# Altium project dashcam_bb_v2.0.PrjPcb (part 8 of 8)

## Sheet mipi_deserializer_poc.SchDoc
size A4; DrawnBy: Elio F; Engineer: Elio F; SheetNumber: 11; SheetTotal: 11; Sheet Title: Mipi Deserilizer LDO
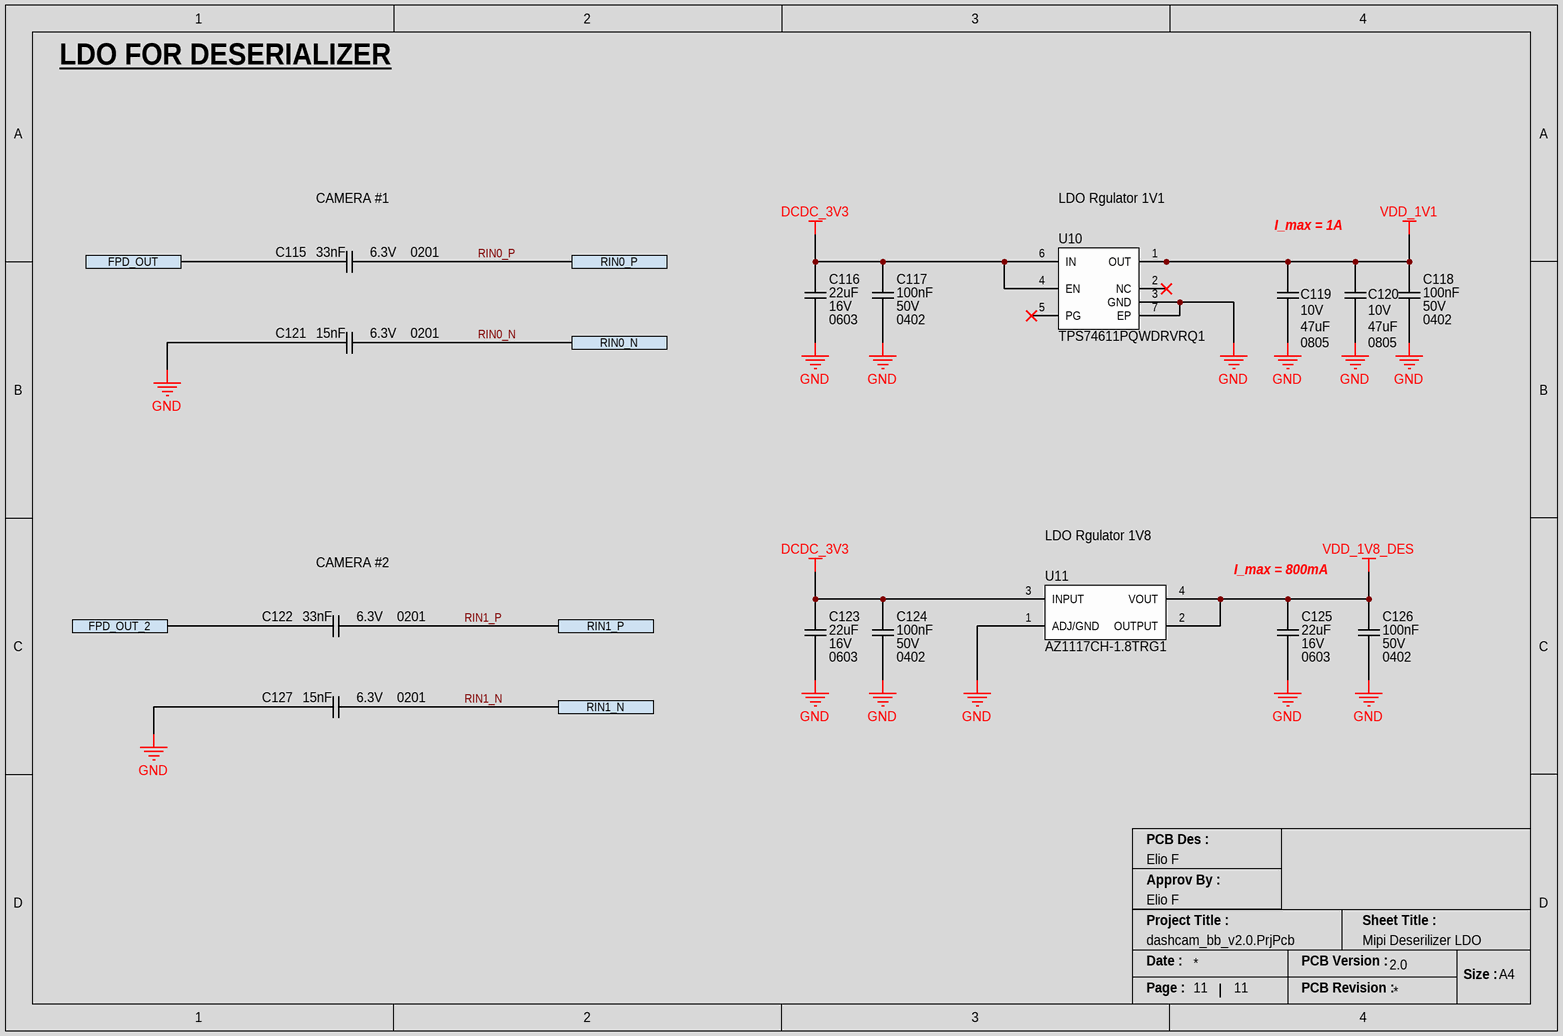
[diagram p11: mipi_deserializer_poc.SchDoc]

### Parts
C115  Voltage Rating: 6.3V  Capacitance: 33nF  Case/Package: 0201  [CAP_0201_CAPC0603X03N]  (hidden comment: GRM033R60J333KE01D)
C116  Capacitance: 22uF  Voltage Rating: 16V  Case/Package: 0603  [CAP_0603_CAPC1608X08N]  (hidden comment: CL10A226MO7JZNC)
C117  Voltage Rating: 50V  Capacitance: 100nF  Case/Package: 0402  [CAP_0402_CAPC1005X05N]  (hidden comment: GRM155R71H104KE14D)
C118  Voltage Rating: 50V  Capacitance: 100nF  Case/Package: 0402  [CAP_0402_CAPC1005X05N]  (hidden comment: GRM155R71H104KE14D)
C119  Voltage Rating (DC): 10V  Capacitance: 47uF  Case Code (Imperial): 0805  [CAP_0805_CAPC2012X12N]  (hidden comment: C2012X5R1A476M125AC)
C120  Voltage Rating (DC): 10V  Capacitance: 47uF  Case Code (Imperial): 0805  [CAP_0805_CAPC2012X12N]  (hidden comment: C2012X5R1A476M125AC)
C121  Voltage Rating: 6.3V  Capacitance: 15nF  Case/Package: 0201  [CAP_0201_CAPC0603X03N]  (hidden comment: GRM033R60J153KE01D)
C122  Voltage Rating: 6.3V  Capacitance: 33nF  Case/Package: 0201  [CAP_0201_CAPC0603X03N]  (hidden comment: GRM033R60J333KE01D)
C123  Capacitance: 22uF  Voltage Rating: 16V  Case/Package: 0603  [CAP_0603_CAPC1608X08N]  (hidden comment: CL10A226MO7JZNC)
C124  Voltage Rating: 50V  Capacitance: 100nF  Case/Package: 0402  [CAP_0402_CAPC1005X05N]  (hidden comment: GRM155R71H104KE14D)
C125  Capacitance: 22uF  Voltage Rating: 16V  Case/Package: 0603  [CAP_0603_CAPC1608X08N]  (hidden comment: CL10A226MO7JZNC)
C126  Voltage Rating: 50V  Capacitance: 100nF  Case/Package: 0402  [CAP_0402_CAPC1005X05N]  (hidden comment: GRM155R71H104KE14D)
C127  Voltage Rating: 6.3V  Capacitance: 15nF  Case/Package: 0201  [CAP_0201_CAPC0603X03N]  (hidden comment: GRM033R60J153KE01D)
U10  TPS74611PQWDRVRQ1  [IC_REG_LDO_1.1V_SON65P200X200X80-7N]
U11  AZ1117CH-1.8TRG1  [SOT230P700X180-4N]

### Ports
FPD_OUT, FPD_OUT_2, RIN0_N, RIN0_P, RIN1_N, RIN1_P

### Nets
DCDC_3V3: C116.2 C117.2 C123.2 C124.2 U10.4(EN) U10.6(IN) U11.3(INPUT)
GND: C116.1 C117.1 C118.1 C119.1 C120.1 C121.1 C123.1 C124.1 C125.1 C126.1 C127.1 U10.3(GND) U10.7(EP) U11.1(ADJ/GND)
VDD_1V1: C118.2 C119.2 C120.2 U10.1(OUT)
VDD_1V8_DES: C125.2 C126.2 U11.2(OUTPUT) U11.4(VOUT)
FPD_OUT: C115.1 ; port FPD_OUT
FPD_OUT_2: C122.1 ; port FPD_OUT_2
RIN0_N: C121.2 ; port RIN0_N
RIN0_P: C115.2 ; port RIN0_P
RIN1_N: C127.2 ; port RIN1_N
RIN1_P: C122.2 ; port RIN1_P

Not connected (* = marked no-connect by the designer): U10 2(NC)* 5(PG)*

### Notes on the sheet
- LDO FOR DESERIALIZER
- CAMERA #1
- LDO Rgulator 1V1
- I_max = 1A
- CAMERA #2
- LDO Rgulator 1V8
- I_max = 800mA
- PCB Des :
- Approv By :
- Project Title :
- Sheet Title :
- Date :
- PCB Version :
- Size :
- A4
- Page :
- PCB Revision :

### Library data of the parts
C115 C122 = CAP_0.033uF_6.3V_X5R_0201: Multilayer Ceramic Capacitor, 0.033 uF, 6.3 V, ± 10%, X5R, 0201 [0603 Metric]; Manufacturer: Murata; Dissipation Factor: 0.1%; Supplier 1: Mouser; Manufacturer Part Number: GRM033R60J333KE01D; RoHS: Yes; Category: Ceramic Capacitors; Stock 1: 164761; Pricing 1: 1=0.1, 10=0.017, 50=0.017, 100=0.011, 1000=0.01, 10000=0.008 (USD); Mount: Surface Mount; Case Code (Metric): 0603; Case Code (Imperial): 0201; Material: Ceramic; Min Operating Temperature: -55°C; Max Operating Temperature: 85°C; Tolerance: 10%; Packaging: Tape and Reel; Voltage Rating (DC): 6.3V; Package Quantity: 1; Dielectric: X5R; Termination: SMD/SMT; Voltage: 6.3V; Series: GRM; Construction: Flat; Length: 0.6mm; Width: 0.012inch; Height: 0.3mm; Thickness: 0.013inch; Depth: 0.3mm; Radiation Hardening: No; Reach SVHC Compliant: No; Lead Free: Lead Free; RoHS Compliant: Yes; ComponentLink1URL: https://datasheet.ciiva.com/131/product-131104.pdf?src-supplier=Digikey; ComponentLink1Description: https://datasheet.ciiva.com/131/product-131104.pdf?src-supplier=Digikey; ComponentLink2URL: https://datasheet.ciiva.com/18184/getdatasheetpartid-220776-18184045.pdf?src-supplier=Verical; ComponentLink2Description: https://datasheet.ciiva.com/18184/getdatasheetpartid-220776-18184045.pdf?src-supplier=Verical; ComponentLink3URL: https://datasheet.ciiva.com/29199/455665-da-01-en-vs-kondensator-0201-29199269.pdf?src-supplier=Conrad; ComponentLink3Description: https://datasheet.ciiva.com/29199/455665-da-01-en-vs-kondensator-0201-29199269.pdf?src-supplier=Conrad; ComponentLink4URL: https://datasheet.ciiva.com/11605/product-11605453.pdf?src-supplier=Avnet; ComponentLink4Description: https://datasheet.ciiva.com/11605/product-11605453.pdf?src-supplier=Avnet; ComponentLink5URL: https://datasheet.ciiva.com/16199/product-16199350.pdf?src-supplier=Future+Electronics; ComponentLink5Description: https://datasheet.ciiva.com/16199/product-16199350.pdf?src-supplier=Future+Electronics; Supplier Part Number 1: 81-GRM033R60J333KE01
C116 C123 C125 = CAP_22UF_16V_X5R_0603: Cap Ceramic 22uF 16V X5R 20% Pad SMD 0603 85C T/R; Manufacturer: Samsung; Supplier 1: Digi-Key; Manufacturer Part Number: CL10A226MO7JZNC; RoHS: Yes; Category: Ceramic Capacitors; Stock 1: 1760065; Pricing 1: 1=0.59, 10=0.419, 50=0.3164, 100=0.2756, 500=0.20418, 1000=0.17355 (USD); Mount: Surface Mount; Case Code (Imperial): 0603; Case Code (Metric): 1608; Min Operating Temperature: -55°C; Max Operating Temperature: 85°C; Packaging: Cut Tape; Tolerance: 20%; Series: CL; RoHS Compliant: Yes; ComponentLink1URL: http://www.samsungsem.com/kr/support/product-search/mlcc/CL10A226MO7JZNC.jsp?src-supplier=Digi-Key; ComponentLink1Description: http://www.samsungsem.com/kr/support/product-search/mlcc/CL10A226MO7JZNC.jsp?src-supplier=Digi-Key; ComponentLink2URL: https://datasheet.octopart.com/CL10A226MO7JZNC-Samsung-Electro-Mechanics-datasheet-149156497.pdf?src-supplier=Future+Electronics; ComponentLink2Description: https://datasheet.octopart.com/CL10A226MO7JZNC-Samsung-Electro-Mechanics-datasheet-149156497.pdf?src-supplier=Future+Electronics; Supplier Part Number 1: 1276-7076-1-ND
C117 C118 C124 C126 = CAP_100NF_50V_X7R_0402: Multilayer Ceramic Capacitor, 0.1 uF, 16 V, ± 10%, X7R, 0402 [1005 Metric]; Manufacturer: Murata; Dissipation Factor: 0.025%; Temperature Coefficient: 30ppm/°C; Supplier 1: DigiKey; Manufacturer Part Number: GRM155R71H104KE14D; RoHS: Yes; Category: Ceramic Capacitors; Stock 1: 13730790; Pricing 1: 1=0.1, 10=0.023, 50=0.0132, 100=0.0102, 500=0.00768, 1000=0.00603, 2500=0.00548, 5000=0.00504 (USD); Mount: Surface Mount; Number of Pins: 2NUMBER; Case Code (Metric): 1005; Material: Ceramic; Case Code (Imperial): 0402; Weight: 0.000212oz; Dielectric Material: Ceramic; Min Operating Temperature: -55°C; Max Operating Temperature: 125°C; Packaging: Tape and Reel; Package Quantity: 10000; Series: GRM; Tolerance: 10%; Dielectric: X7R; Termination: SMD/SMT; Voltage: 50V; Voltage Rating (DC): 50V; Construction: Flat; Length: 1mm; Width: 0.5mm; Height: 0.5mm; Depth: 0.5mm; Thickness: 0.022inch; Reach SVHC Compliant: No; RoHS Compliant: Yes; Lead Free: 5697LeadFree; ComponentLink1URL: http://www.farnell.com/datasheets/2079156.pdf?src-supplier=Farnell; ComponentLink1Description: http://www.farnell.com/datasheets/2079156.pdf?src-supplier=Farnell; ComponentLink2URL: http://www.mouser.com/ds/2/281/c02e-2905.pdf?src-supplier=Mouser; ComponentLink2Description: http://www.mouser.com/ds/2/281/c02e-2905.pdf?src-supplier=Mouser; ComponentLink3URL: http://www.farnell.com/datasheets/2079156.pdf?src-supplier=Newark; ComponentLink3Description: http://www.farnell.com/datasheets/2079156.pdf?src-supplier=Newark; ComponentLink4URL: https://datasheet.octopart.com/GRM155R71H104KE14D-Murata-datasheet-22122223.pdf?src-supplier=Future+Electronics; ComponentLink4Description: https://datasheet.octopart.com/GRM155R71H104KE14D-Murata-datasheet-22122223.pdf?src-supplier=Future+Electronics; ComponentLink5URL: https://search.murata.co.jp/Ceramy/image/img/A01X/G101/ENG/GRM155R71H104KE14-01.pdf?src-supplier=Digi-Key; ComponentLink5Description: https://search.murata.co.jp/Ceramy/image/img/A01X/G101/ENG/GRM155R71H104KE14-01.pdf?src-supplier=Digi-Key; ComponentLink6URL: http://psearch.en.murata.com/capacitor/product/GRM155R71H104KE14%23.pdf?src-supplier=Avnet; ComponentLink6Description: http://psearch.en.murata.com/capacitor/product/GRM155R71H104KE14%23.pdf?src-supplier=Avnet; ComponentLink7URL: https://datasheet.octopart.com/GRM155R71H104KE14D-Murata-datasheet-66077078.pdf?src-supplier=Element14; ComponentLink7Description: https://datasheet.octopart.com/GRM155R71H104KE14D-Murata-datasheet-66077078.pdf?src-supplier=Element14; Supplier Part Number 1: 490-10700-6-ND; Supplier 2: Digikey; Stock 2: 3706055; Pricing 2: 1=0.1, 10=0.037, 50=0.021, 100=0.0162, 500=0.01224, 1000=0.00961, 2500=0.00874, 5000=0.00804 (USD); Halogen Free: 5694HalogenFree; ComponentLink8URL: http://www.mouser.com/ds/2/447/UPY-GPHC_X5R_4V-to-50V_25-1131599.pdf?src-supplier=Mouser; ComponentLink8Description: http://www.mouser.com/ds/2/447/UPY-GPHC_X5R_4V-to-50V_25-1131599.pdf?src-supplier=Mouser; ComponentLink9URL: https://datasheet.octopart.com/CC0402KRX5R8BB104-Yageo-datasheet-137700082.pdf?src-supplier=Future+Electronics; ComponentLink9Description: https://datasheet.octopart.com/CC0402KRX5R8BB104-Yageo-datasheet-137700082.pdf?src-supplier=Future+Electronics; ComponentLink10URL: http://www.yageo.com/documents/recent/UPY-GPHC_X5R_4V-to-50V_25.pdf?src-supplier=Digikey; ComponentLink10Description: http://www.yageo.com/documents/recent/UPY-GPHC_X5R_4V-to-50V_25.pdf?src-supplier=Digikey; ComponentLink11URL: https://datasheet.octopart.com/CC0402KRX5R8BB104-Yageo-datasheet-140260304.pdf?src-supplier=Newark; ComponentLink11Description: https://datasheet.octopart.com/CC0402KRX5R8BB104-Yageo-datasheet-140260304.pdf?src-supplier=Newark; ComponentLink12URL: https://datasheet.octopart.com/CC0402KRX5R8BB104-Yageo-datasheet-170350636.pdf?src-supplier=Future+Electronics; ComponentLink12Description: https://datasheet.octopart.com/CC0402KRX5R8BB104-Yageo-datasheet-170350636.pdf?src-supplier=Future+Electronics; ComponentLink13URL: http://www.yageo.com/documents/recent/UPY-GPHC_X5R_4V-to-50V-16.pdf?src-supplier=Future+Electronics; ComponentLink13Description: http://www.yageo.com/documents/recent/UPY-GPHC_X5R_4V-to-50V-16.pdf?src-supplier=Future+Electronics; Supplier Part Number 2: 311-1697-1-ND
C119 C120 = CAP_47UF_10V_X5R_0805: Multilayer Ceramic Capacitor, 47 uF, 10 V, ± 20%, X5R, 0805 [2012 Metric]; Manufacturer: TDK; Material: 4241ConductorMaterial; Supplier 1: Digikey; Manufacturer Part Number: C2012X5R1A476M125AC; RoHS: Yes; Category: Ceramic Capacitors; Stock 1: 476295; Pricing 1: 1=0.79, 10=0.572, 50=0.5006, 100=0.4079, 500=0.33372, 1000=0.28737 (USD); Mount: Surface Mount; Case/Package: 0805; Dielectric Material: Ceramic; Case Code (Metric): 2012; Weight: 0.000194oz; Min Operating Temperature: -55°C; Max Operating Temperature: 85°C; Tolerance: 20%; Packaging: Tape and Reel; Dielectric: X5R; Package Quantity: 1; Voltage Rating: 10V; Termination: SMD/SMT; Voltage: 10V; Series: C; Length: 2mm; Width: 0.049inch; Height: 1.25mm; Depth: 1.25mm; Thickness: 0.057inch; Lead Free: Lead Free; Reach SVHC Compliant: No; RoHS Compliant: Yes; ComponentLink1URL: https://datasheet.ciiva.com/24216/c2012x5r1a476m125ac-264921-24216523.pdf?src-supplier=Mouser; ComponentLink1Description: https://datasheet.ciiva.com/24216/c2012x5r1a476m125ac-264921-24216523.pdf?src-supplier=Mouser; ComponentLink2URL: https://datasheet.ciiva.com/24191/c2012x5r1a476m125ac-24191773.pdf?src-supplier=Future+Electronics; ComponentLink2Description: https://datasheet.ciiva.com/24191/c2012x5r1a476m125ac-24191773.pdf?src-supplier=Future+Electronics; ComponentLink3URL: https://datasheet.ciiva.com/7975/1796654-7975085.pdf?src-supplier=Element14; ComponentLink3Description: https://datasheet.ciiva.com/7975/1796654-7975085.pdf?src-supplier=Element14; ComponentLink4URL: https://datasheet.ciiva.com/22694/1796654-22694142.pdf?src-supplier=Element14; ComponentLink4Description: https://datasheet.ciiva.com/22694/1796654-22694142.pdf?src-supplier=Element14; ComponentLink5URL: https://datasheet.ciiva.com/6259/tdkmlcccaprange-6259576.pdf?src-supplier=Digikey; ComponentLink5Description: https://datasheet.ciiva.com/6259/tdkmlcccaprange-6259576.pdf?src-supplier=Digikey; ComponentLink6URL: https://datasheet.ciiva.com/6259/tdkmlcccaprange-6259575.pdf?src-supplier=Digikey; ComponentLink6Description: https://datasheet.ciiva.com/6259/tdkmlcccaprange-6259575.pdf?src-supplier=Digikey; ComponentLink7URL: https://datasheet.ciiva.com/6259/tdkmlcccaprange-6259577.pdf?src-supplier=Digikey; ComponentLink7Description: https://datasheet.ciiva.com/6259/tdkmlcccaprange-6259577.pdf?src-supplier=Digikey; Supplier Part Number 1: 445-8239-6-ND
C121 C127 = CAP_0.015uF_6.3V_X5R_0201: 0201 15 nF 6.3 V ±10% Tolerance X5R SMT Multilayer Ceramic Capacitor; Manufacturer: Murata; Supplier 1: Mouser; Manufacturer Part Number: GRM033R60J153KE01D; RoHS: Yes; Category: Ceramic Capacitors; Stock 1: 84989; Pricing 1: 1=0.1, 10=0.014, 50=0.014, 100=0.007, 1000=0.005, 10000=0.005 (USD); Mount: Surface Mount; Case Code (Metric): 0603; Case Code (Imperial): 0201; Material: Ceramic; Min Operating Temperature: -55°C; Max Operating Temperature: 85°C; Package Quantity: 1; Tolerance: 10%; Packaging: Tape and Reel; Voltage Rating (DC): 6.3V; Dielectric: X5R; Termination: SMD/SMT; Series: GRM; Construction: Flat; Length: 0.6mm; Width: 0.012inch; Height: 0.3mm; Thickness: 0.013inch; Depth: 0.3mm; Radiation Hardening: No; Lead Free: Lead Free; RoHS Compliant: Yes; ComponentLink1URL: https://datasheet.ciiva.com/130/product-130817.pdf?src-supplier=Digikey; ComponentLink1Description: https://datasheet.ciiva.com/130/product-130817.pdf?src-supplier=Digikey; ComponentLink2URL: https://datasheet.ciiva.com/18184/getdatasheetpartid-306886-18184038.pdf?src-supplier=Verical; ComponentLink2Description: https://datasheet.ciiva.com/18184/getdatasheetpartid-306886-18184038.pdf?src-supplier=Verical; ComponentLink3URL: https://datasheet.ciiva.com/29199/455637-da-01-en-vs-kondensator-0201-29199258.pdf?src-supplier=Conrad; ComponentLink3Description: https://datasheet.ciiva.com/29199/455637-da-01-en-vs-kondensator-0201-29199258.pdf?src-supplier=Conrad; ComponentLink4URL: https://datasheet.ciiva.com/130/grm033r60j153ke01-01-130818.pdf?src-supplier=Digikey; ComponentLink4Description: https://datasheet.ciiva.com/130/grm033r60j153ke01-01-130818.pdf?src-supplier=Digikey; ComponentLink5URL: https://datasheet.ciiva.com/130/grm033r60j153ke01-01-130819.pdf?src-supplier=Digikey; ComponentLink5Description: https://datasheet.ciiva.com/130/grm033r60j153ke01-01-130819.pdf?src-supplier=Digikey; ComponentLink6URL: https://datasheet.ciiva.com/11619/product-11619495.pdf?src-supplier=Avnet; ComponentLink6Description: https://datasheet.ciiva.com/11619/product-11619495.pdf?src-supplier=Avnet; Supplier Part Number 1: 81-GRM033R60J153KE1D
U10 = IC_REG_LDO_1.1V_1A_TPS74611PQWDRVRQ1: Voltage Regulator; linear, LDO; fixed; Vout: 1.1V; Vin: 1.5-6V; 1A; -40+125 deg.C; SMD; WSON6; Manufacturer: Texas Instruments; Supplier 1: Digikey; Manufacturer Part Number: TPS74611PQWDRVRQ1; RoHS: Yes; Category: Integrated Circuits (ICs); Stock 1: 29876; Pricing 1: 1=1.26, 10=0.915, 25=0.8288, 100=0.7334, 250=0.68796, 500=0.66054, 1000=0.63799, 3000=0.61013, 6000=0.59649, 9000=0.58967, 15000=0.5821 (USD); RoHS Compliant: Yes; Supplier Part Number 1: 296-TPS74611PQWDRVRQ1CT-ND
U11 = IC_REG_LDO_1.8_1A_AZ1117CH-1.8TRG1: AZ1117C Series 1.8 V 800 mA Fixed Surface Mount Voltage Regulator - SOT-223; Manufacturer: Diodes; Number of Outputs: 1; Max Input Voltage: 15V; Output Voltage: 1.8V; Dropout Voltage: 1.2V; Output Current: 800mA; Min Current Limit: 1A; Polarity: Positive; Quiescent Current: 6mA; Reference Voltage: 1.262V; Max Output Current: 1.35A; Accuracy: 1%; Supplier 1: Digikey; Manufacturer Part Number: AZ1117CH-1.8TRG1; RoHS: Yes; Category: Voltage Regulators - Linear; Stock 1: 40000; Pricing 1: 4000=0.06801, 8000=0.06219, 12000=0.05925, 20000=0.05597, 28000=0.05488 (USD); Mount: Surface Mount; Case/Package: SOT-223; Number of Pins: 3; Min Operating Temperature: -20°C; Max Operating Temperature: 125°C; Package Quantity: 4000; Packaging: Cut Tape; Number of Regulators: 1; Output Type: Fixed; Series: -; Number of Channels: 1; Length: 6.7mm; Width: 3.7mm; Height: 1.7mm; RoHS Compliant: Yes; ComponentLink1URL: https://datasheet.ciiva.com/29569/az1117c-29569909.pdf?src-supplier=Digikey; ComponentLink1Description: https://datasheet.ciiva.com/29569/az1117c-29569909.pdf?src-supplier=Digikey; Supplier Part Number 1: AZ1117CH-1.8TRG1DITR-ND

## Nets that join several sheets
DCDC_3V3: connector_a (R3.1 R4.1 U1.7), imu (5 pins), mipi_serializer1 (C34.2 R47.2 U6.A1), camera_connector (9 pins), mipi_serializer2 (C59.2 R60.2 U8.A1), mipi_deserializer (J10.1), mipi_deserializer_poc (7 pins)
GND: connector_a (U1.2), gnss_gps (16 pins), imu (14 pins), mipi_serializer1 (31 pins), camera_connector (36 pins), mipi_serializer2 (31 pins), mipi_deserializer (62 pins), mipi_deserializer_poc (14 pins)
VDD_1V1: mipi_deserializer (6 pins), mipi_deserializer_poc (C118.2 C119.2 C120.2 U10.1)
VDD_1V8: connector_a (5 pins), mipi_serializer1 (7 pins)
VDD_1V8_2: connector_a (R2.2), mipi_serializer2 (C60.2 C61.2 R57.2 U8.A2)
VDD_1V8_DES: mipi_deserializer (14 pins), mipi_deserializer_poc (C125.2 C126.2 U11.2 U11.4)
CSI1_CK_N: mipi_serializer1 (U5.6), camera_connector (D9.5 D9.6 J3.10)
CSI1_CK_P: mipi_serializer1 (U5.5), camera_connector (D9.4 D9.7 J3.11)
CSI1_D0_N: mipi_serializer1 (U5.4), camera_connector (D3.1 D3.10 J3.2)
CSI1_D0_P: mipi_serializer1 (U5.3), camera_connector (D3.2 D3.9 J3.3)
CSI1_D1_N: mipi_serializer1 (U5.2), camera_connector (D3.4 D3.7 J3.4)
CSI1_D1_P: mipi_serializer1 (U5.1), camera_connector (D3.5 D3.6 J3.5)
CSI1_D2_N: mipi_serializer1 (U5.32), camera_connector (D6.1 D6.10 J3.6)
CSI1_D2_P: mipi_serializer1 (U5.31), camera_connector (D6.2 D6.9 J3.7)
CSI1_D3_N: mipi_serializer1 (U5.30), camera_connector (D6.4 D6.7 J3.8)
CSI1_D3_P: mipi_serializer1 (U5.29), camera_connector (D6.5 D6.6 J3.9)
CSI1_MCLK_R: mipi_serializer1 (R42.1), camera_connector (J3.19)
CSI1_nRST_R: mipi_serializer1 (R37.2), camera_connector (J3.13)
CSI1_PWDN_R: mipi_serializer1 (R38.2), camera_connector (J3.18)
CSI2_MCLK_R: connector_b (R19.2), camera_connector (J4.19)
CSI2_nRST_R: connector_b (R14.2), camera_connector (J4.13)
CSI2_PWDN_R: connector_b (R18.2), camera_connector (J4.18)
CSI2_SYNC_R: connector_b (R16.2), camera_connector (J4.14)
CSI3_CK_N: camera_connector (D11.5 D11.6 J5.10), mipi_serializer2 (U7.6)
CSI3_CK_P: camera_connector (D11.4 D11.7 J5.11), mipi_serializer2 (U7.5)
CSI3_D0_N: camera_connector (D5.1 D5.10 J5.2), mipi_serializer2 (U7.4)
CSI3_D0_P: camera_connector (D5.2 D5.9 J5.3), mipi_serializer2 (U7.3)
CSI3_D1_N: camera_connector (D5.4 D5.7 J5.4), mipi_serializer2 (U7.2)
CSI3_D1_P: camera_connector (D5.5 D5.6 J5.5), mipi_serializer2 (U7.1)
CSI3_D2_N: camera_connector (D8.1 D8.10 J5.6), mipi_serializer2 (U7.32)
CSI3_D2_P: camera_connector (D8.2 D8.9 J5.7), mipi_serializer2 (U7.31)
CSI3_D3_N: camera_connector (D8.4 D8.7 J5.8), mipi_serializer2 (U7.30)
CSI3_D3_P: camera_connector (D8.5 D8.6 J5.9), mipi_serializer2 (U7.29)
CSI3_MCLK_R: camera_connector (J5.19), mipi_serializer2 (R55.1)
CSI3_nRST_R: camera_connector (J5.13), mipi_serializer2 (R50.2)
CSI3_PWDN_R: camera_connector (J5.18), mipi_serializer2 (R51.2)
FPD_OUT: mipi_serializer1 (C20.2), mipi_deserializer_poc (C115.1)
FPD_OUT_2: mipi_serializer2 (C45.2), mipi_deserializer_poc (C122.1)
GPIO1_IO00: connector_b (R15.1), imu (U12.7)
GPIO1_IO08: connector_b (R12.1), imu (U12.8)
GPIO1_IO09: connector_b (R13.1), imu (U12.9)
INT_GPS: connector_a (R8.1), gnss_gps (U2.4)
MISO_GPS: connector_a (R11.1), gnss_gps (R22.2)
MOSI_GPS: connector_a (R9.1), gnss_gps (R23.2)
RESET_GPS: connector_a (R7.1), gnss_gps (U2.8)
RIN0_N: mipi_deserializer (U9.51), mipi_deserializer_poc (C121.2)
RIN0_P: mipi_deserializer (U9.50), mipi_deserializer_poc (C115.2)
RIN1_N: mipi_deserializer (U9.54), mipi_deserializer_poc (C127.2)
RIN1_P: mipi_deserializer (U9.53), mipi_deserializer_poc (C122.2)
SAFE_GPS: connector_a (R10.1), gnss_gps (U2.1)
SCL_1V8: connector_a (R5.1 U1.5), imu (R31.1 U4.23), mipi_serializer1 (U5.24), camera_connector (J3.16 J4.16 J5.16), mipi_serializer2 (U7.24), mipi_deserializer (U9.12)
SCL_3V3: connector_a (R3.2 U1.8), gnss_gps (R21.2)
SDA_1V8: connector_a (R6.1 U1.4), imu (R30.1 U4.24), mipi_serializer1 (U5.23), camera_connector (J3.17 J4.17 J5.17), mipi_serializer2 (U7.23), mipi_deserializer (U9.11)
SDA_3V3: connector_a (R4.2 U1.1), gnss_gps (R20.2)
SLASEL2_R: connector_b (R17.2), camera_connector (J4.15 J5.15)

## Assembly variants
Base Variant: not fitted C65 C79 C88 C95 C104 J2 R36 R40 R49 R53 R73 R76